# Altium schematic sheet CC-S01-V00-Microcontroller.SchDoc: Microcontroller (STM32F765VI)
size A3; DrawnBy: Jonn Dillon; DocumentNumber: 2; SheetNumber: 2; SheetTotal: 13; Project: Chassis Controller (Interim) 2020
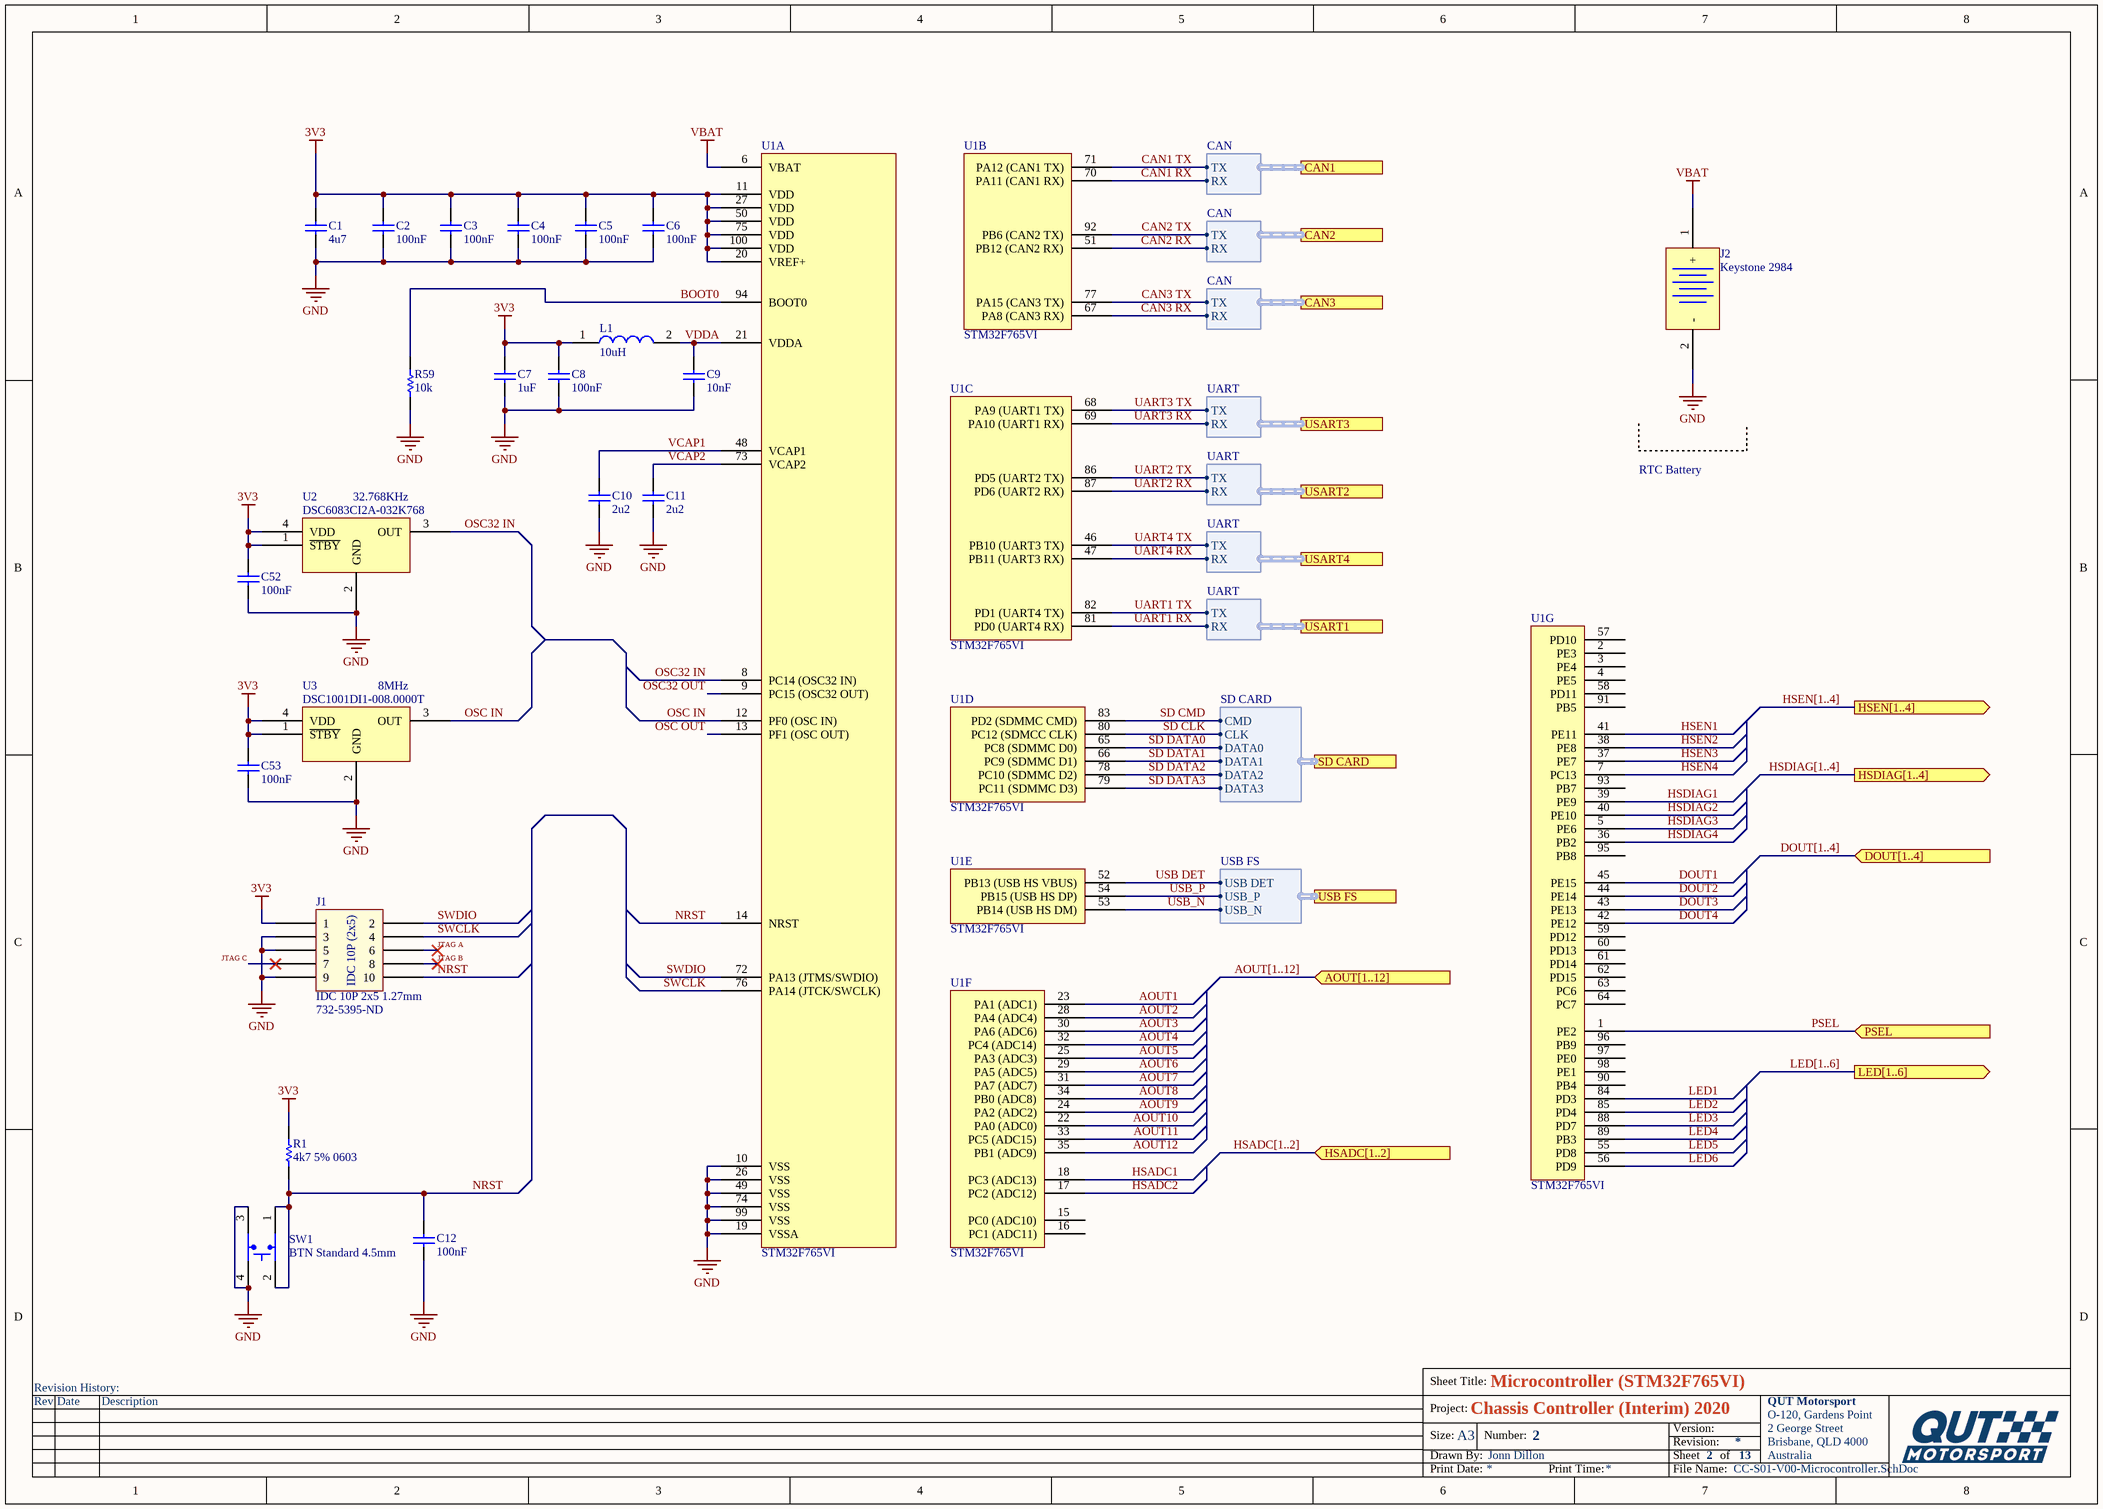
[diagram p0: CC-S01-V00-Microcontroller.SchDoc]

## Parts
C1  4u7  [Cap_Ceramic_0603]
C2  100nF  [Cap_Ceramic_0603]
C3  100nF  [Cap_Ceramic_0603]
C4  100nF  [Cap_Ceramic_0603]
C5  100nF  [Cap_Ceramic_0603]
C6  100nF  [Cap_Ceramic_0603]
C7  1uF  [Cap_Ceramic_0603]
C8  100nF  [Cap_Ceramic_0603]
C9  10nF  [Cap_Ceramic_0603]
C10  2u2  [Cap_Ceramic_0603]
C11  2u2  [Cap_Ceramic_0603]
C12  100nF  [Cap_Ceramic_0603]
C52  100nF  [Cap_Ceramic_0603]
C53  100nF  [Cap_Ceramic_0603]
J1  IDC 10P 2x5 1.27mm  [IDC 1.27MM 10P]
J2  Keystone 2984  [KEYSTONE 2894]
L1  10uH  [Inductor_0603]
R1  4k7 5% 0603  [Res_ThinFilm_0603]
R59  10k  [Res_ThinFilm_0603]
SW1  BTN Standard 4.5mm  [BTN STANDARD 4.5mm X 4.5mm]
U1  STM32F765VI  [LQFP-100]  (parts A,B,C,D,E,F,G of 7)
U2  DSC6083CI2A-032K768  [DSC6083CI2A-032K768]
U3  DSC1001DI1-008.0000T  [DSC1001DI1-008.0000TCT-ND]

## Ports
AOUT[1..12] (in), CAN1 (harness CAN), CAN2 (harness CAN), CAN3 (harness CAN), DOUT[1..4] (in), HSADC[1..2] (in), HSDIAG[1..4] (out), HSEN[1..4] (out), LED[1..6] (out), PSEL (in), SD CARD (harness SD CARD), USART1 (harness UART), USART2 (harness UART), USART3 (harness UART), USART4 (harness UART), USB FS (harness USB FS)

## Harnesses
USB FS: USB DET, USB_N, USB_P
SD CARD: DATA2, DATA3, CMD, CLK, DATA0, DATA1
UART: TX, RX
CAN: RX, TX

## Nets
3V3: C1.2 C2.2 C3.2 C4.2 C5.2 C6.2 C7.2 C8.2 C52.2 C53.2 J1.1 L1.1 R1.2 U1.11(VDD) U1.20(VREF+) U1.27(VDD) U1.50(VDD) U1.75(VDD) U1.100(VDD) U2.1(~{STBY}) U2.4(VDD) U3.1(~{STBY}) U3.4(VDD)
GND: C1.1 C2.1 C3.1 C4.1 C5.1 C6.1 C7.1 C8.1 C9.1 C10.1 C11.1 C12.1 C52.1 C53.1 J1.3 J1.5 J1.9 J2.2(-) R59.1 SW1.3 SW1.4 U1.10(VSS) U1.19(VSSA) U1.26(VSS) U1.49(VSS) U1.74(VSS) U1.99(VSS) U2.2(GND) U3.2(GND)
VBAT: J2.1(+) U1.6(VBAT)
AOUT1: U1.23(PA1_(ADC1))
AOUT2: U1.28(PA4_(ADC4))
AOUT3: U1.30(PA6_(ADC6))
AOUT4: U1.32(PC4_(ADC14))
AOUT5: U1.25(PA3_(ADC3))
AOUT6: U1.29(PA5_(ADC5))
AOUT7: U1.31(PA7_(ADC7))
AOUT8: U1.34(PB0_(ADC8))
AOUT9: U1.24(PA2_(ADC2))
AOUT10: U1.22(PA0_(ADC0))
AOUT11: U1.33(PC5_(ADC15))
AOUT12: U1.35(PB1_(ADC9))
BOOT0: R59.2 U1.94(BOOT0)
CAN1 RX: U1.70(PA11_(CAN1_RX)) ; port CAN1.RX
CAN1 TX: U1.71(PA12_(CAN1_TX)) ; port CAN1.TX
CAN2 RX: U1.51(PB12_(CAN2_RX)) ; port CAN2.RX
CAN2 TX: U1.92(PB6_(CAN2_TX)) ; port CAN2.TX
CAN3 RX: U1.67(PA8_(CAN3_RX)) ; port CAN3.RX
CAN3 TX: U1.77(PA15_(CAN3_TX)) ; port CAN3.TX
DOUT1: U1.45(PE15)
DOUT2: U1.44(PE14)
DOUT3: U1.43(PE13)
DOUT4: U1.42(PE12)
HSADC1: U1.18(PC3_(ADC13))
HSADC2: U1.17(PC2_(ADC12))
HSDIAG1: U1.39(PE9)
HSDIAG2: U1.40(PE10)
HSDIAG3: U1.5(PE6)
HSDIAG4: U1.36(PB2)
HSEN1: U1.41(PE11)
HSEN2: U1.38(PE8)
HSEN3: U1.37(PE7)
HSEN4: U1.7(PC13)
JTAG A: J1.6
JTAG B: J1.8
JTAG C: J1.7
LED1: U1.84(PD3)
LED2: U1.85(PD4)
LED3: U1.88(PD7)
LED4: U1.89(PB3)
LED5: U1.55(PD8)
LED6: U1.56(PD9)
NRST: C12.2 J1.10 R1.1 SW1.1 SW1.2 U1.14(NRST)
OSC32 IN: U1.8(PC14_(OSC32_IN)) U2.3(OUT)
OSC32 OUT: U1.9(PC15_(OSC32_OUT))
OSC IN: U1.12(PF0_(OSC_IN)) U3.3(OUT)
OSC OUT: U1.13(PF1_(OSC_OUT))
PSEL: U1.1(PE2) ; port PSEL
SD CLK: U1.80(PC12_(SDMCC_CLK)) ; port SD CARD.CLK
SD CMD: U1.83(PD2_(SDMMC_CMD)) ; port SD CARD.CMD
SD DATA0: U1.65(PC8_(SDMMC_D0)) ; port SD CARD.DATA0
SD DATA1: U1.66(PC9_(SDMMC_D1)) ; port SD CARD.DATA1
SD DATA2: U1.78(PC10_(SDMMC_D2)) ; port SD CARD.DATA2
SD DATA3: U1.79(PC11_(SDMMC_D3)) ; port SD CARD.DATA3
SWCLK: J1.4 U1.76(PA14_(JTCK/SWCLK))
SWDIO: J1.2 U1.72(PA13_(JTMS/SWDIO))
UART1 RX: U1.81(PD0_(UART4_RX)) ; port USART1.RX
UART1 TX: U1.82(PD1_(UART4_TX)) ; port USART1.TX
UART2 RX: U1.87(PD6_(UART2_RX)) ; port USART2.RX
UART2 TX: U1.86(PD5_(UART2_TX)) ; port USART2.TX
UART3 RX: U1.69(PA10_(UART1_RX)) ; port USART3.RX
UART3 TX: U1.68(PA9_(UART1_TX)) ; port USART3.TX
UART4 RX: U1.47(PB11_(UART3_RX)) ; port USART4.RX
UART4 TX: U1.46(PB10_(UART3_TX)) ; port USART4.TX
USB DET: U1.52(PB13_(USB_HS_VBUS)) ; port USB FS.USB DET
USB_N: U1.53(PB14_(USB_HS_DM)) ; port USB FS.USB_N
USB_P: U1.54(PB15_(USB_HS_DP)) ; port USB FS.USB_P
VCAP1: C10.2 U1.48(VCAP1)
VCAP2: C11.2 U1.73(VCAP2)
VDDA: C9.2 L1.2 U1.21(VDDA)

Not connected (* = marked no-connect by the designer): U1 2(PE3) 3(PE4) 4(PE5) 15(PC0_(ADC10)) 16(PC1_(ADC11)) 57(PD10) 58(PD11) 59(PD12) 60(PD13) 61(PD14) 62(PD15) 63(PC6) 64(PC7) 90(PB4) 91(PB5) 93(PB7) 95(PB8) 96(PB9) 97(PE0) 98(PE1)

## Buses and harness runs
bus AOUT[1..12] = port AOUT[1..12]
bus DOUT[1..4] = port DOUT[1..4]
bus HSADC[1..2] = port HSADC[1..2]
bus HSDIAG[1..4] = port HSDIAG[1..4]
bus HSEN[1..4] = port HSEN[1..4]
bus LED[1..6] = port LED[1..6]

## Notes on the sheet
- (near U2) 32.768KHz
- RTC Battery
- (near U3) 8MHz
- (near J1) 732-5395-ND
- Revision History:
- Sheet Title:
- Rev
- Date
- Description
- Project:
- Size:
- Drawn By:
- A3
- Number:
- Revision:
- Sheet
- Version:
- of
- QUT Motorsport
- O-120, Gardens Point
- 2 George Street
- Brisbane, QLD 4000
- Australia
- Print Date:
- Print Time:
- File Name:
- (in symbol IDC 10P 2x5 1.27mm) IDC 10P (2x5)

## Library data of the parts
C1 = 4u7 50V 5% X7R 0603: Capacitor, Ceramic, SMD, 4u7, 50V, 5%, X7R, 0603
C2-C6 C8 C12 C52 C53 = 100nF 50V 5% X7R 0603: Capacitor, Ceramic, SMD, 100nF, 50V, 5%, X7R, 0603
C7 = 1uF 25V 5% X7R 0603: Capacitor, Ceramic, SMD, 1uF, 25V, 5%, X7R, 0603
C9 = 10nF 50V 5% X7R 0603: Capacitor, Ceramic, SMD, 10nF, 50V, 5%, X7R, 0603
C10 C11 = 2u2 25V 5% X7R 0603: Capacitor, Ceramic, SMD, 2u2, 25V, 5%, X7R, 0603
J2 = Keystone 2984: Battery Retainer Coin, 12.0mm 1 Cell SMD (SMT) Tab
L1 = 10uH, 10%, 0603: ComponentLink1Description: Digikey; ComponentLink1URL: https://www.digikey.com.au/product-detail/en/w%C3%BCrth-elektronik/74404064221/732-7261-1-ND/5353241; ComponentLink2Description: LCSC A; ComponentLink2URL: https://lcsc.com/product-detail/Power-Inductors_Sunlord-SWPA6045S221MT_C91047.html; ComponentLink3Description: LCSC B; ComponentLink3URL: https://lcsc.com/product-detail/Power-Inductors_SXN-Shun-Xiang-Nuo-Elec-SMNR6045-221MT_C467145.html
R1 = 4k7 5% 0603: Resistor, SMD, 4k7, 0.1W, 5%, 0603
R59 = 10k 5% 0603: Resistor, SMD, 10k, 0.1W, 5%, 0603
SW1 = BTN Standard 4.5mm: Standard 4.5mm X 4.5mm momentary button; ComponentLink1Description: LCSC; ComponentLink1URL: https://lcsc.com/product-detail/Tactile-Switches_BRIGHT-TSA063G50-250_C294565.html
U1 = STM32F765VI: ARM® Cortex®-M7 STM32F7 Microcontroller IC 32-Bit 216MHz 2MB (2M x 8) FLASH 100-LQFP (14x14); ComponentLink1Description: Digikey; ComponentLink1URL: https://www.digikey.com/product-detail/en/stmicroelectronics/STM32F765VIT6/497-16631-ND/6137842; ComponentLink2Description: Datasheet
U2 = DSC6083CI2A-032K768: 32.768kHz XO (Standard) CMOS Oscillator 1.8V ~ 3.3V 4-SMD, No Lead
U3 = DSC1001DI1-008.0000T: 8MHz XO (Standard) CMOS Oscillator 1.8 ~ 3.3V Standby (Power Down) 4-SMD, No Lead